# Altium schematic sheet USB.SchDoc
size A4
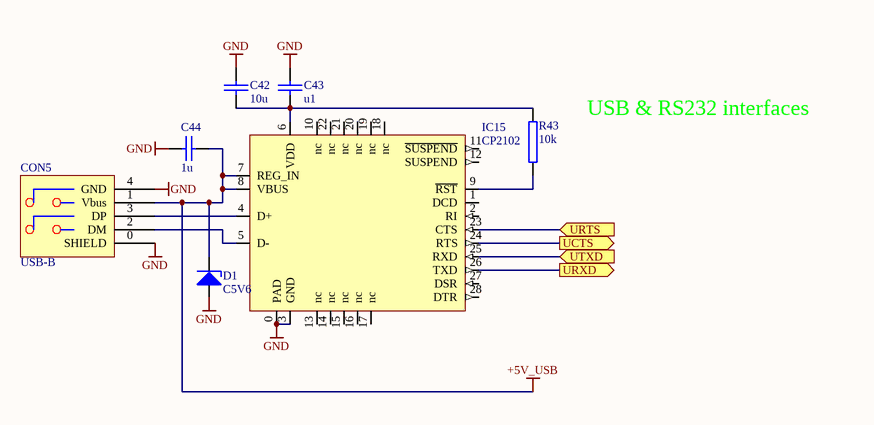
[diagram p0: USB.SchDoc]

## Parts
C42  10u  [1206]
C43  u1  [0603]
C44  1u  [0805]
CON5  USB-B  [USBB-G]
D1  C5V6  [SOD80]
IC15  CP2102  [QFN28]
R43  10k  [0603]

## Ports
UCTS (out), URTS (in), URXD (out), UTXD (in)

## Nets
+5V_USB: C44.2 CON5.1(Vbus) D1.K IC15.7(REG_IN) IC15.8(VBUS)
GND: C42.2 C43.2 C44.1 CON5.0(SHIELD) CON5.4(GND) D1.A IC15.0(PAD) IC15.3(GND)
UCTS: IC15.24(RTS) ; port UCTS
URTS: IC15.23(CTS) ; port URTS
URXD: IC15.26(TXD) ; port URXD
UTXD: IC15.25(RXD) ; port UTXD
NetC42_1: C42.1 C43.1 IC15.6(VDD) R43.1
NetCON5_2: CON5.2(DM) IC15.5(D-)
NetCON5_3: CON5.3(DP) IC15.4(D+)
NetIC15_9: IC15.9(~{RST}) R43.2

Not connected (* = marked no-connect by the designer): IC15 1(DCD) 2(RI) 10(nc) 11(~{SUSPEND}) 12(SUSPEND) 13(nc) 14(nc) 15(nc) 16(nc) 17(nc) 18(nc) 19(nc) 20(nc) 21(nc) 22(nc) 27(DSR) 28(DTR)

## Notes on the sheet
- USB & RS232 interfaces

## Library data of the parts
C42-C44 = CAP_SMD: Capacitor SMD
CON5 = USB_CON_B: USB connector B type (TME)
D1 = ZENER1: Zener Diode
R43 = RES2: Resistor